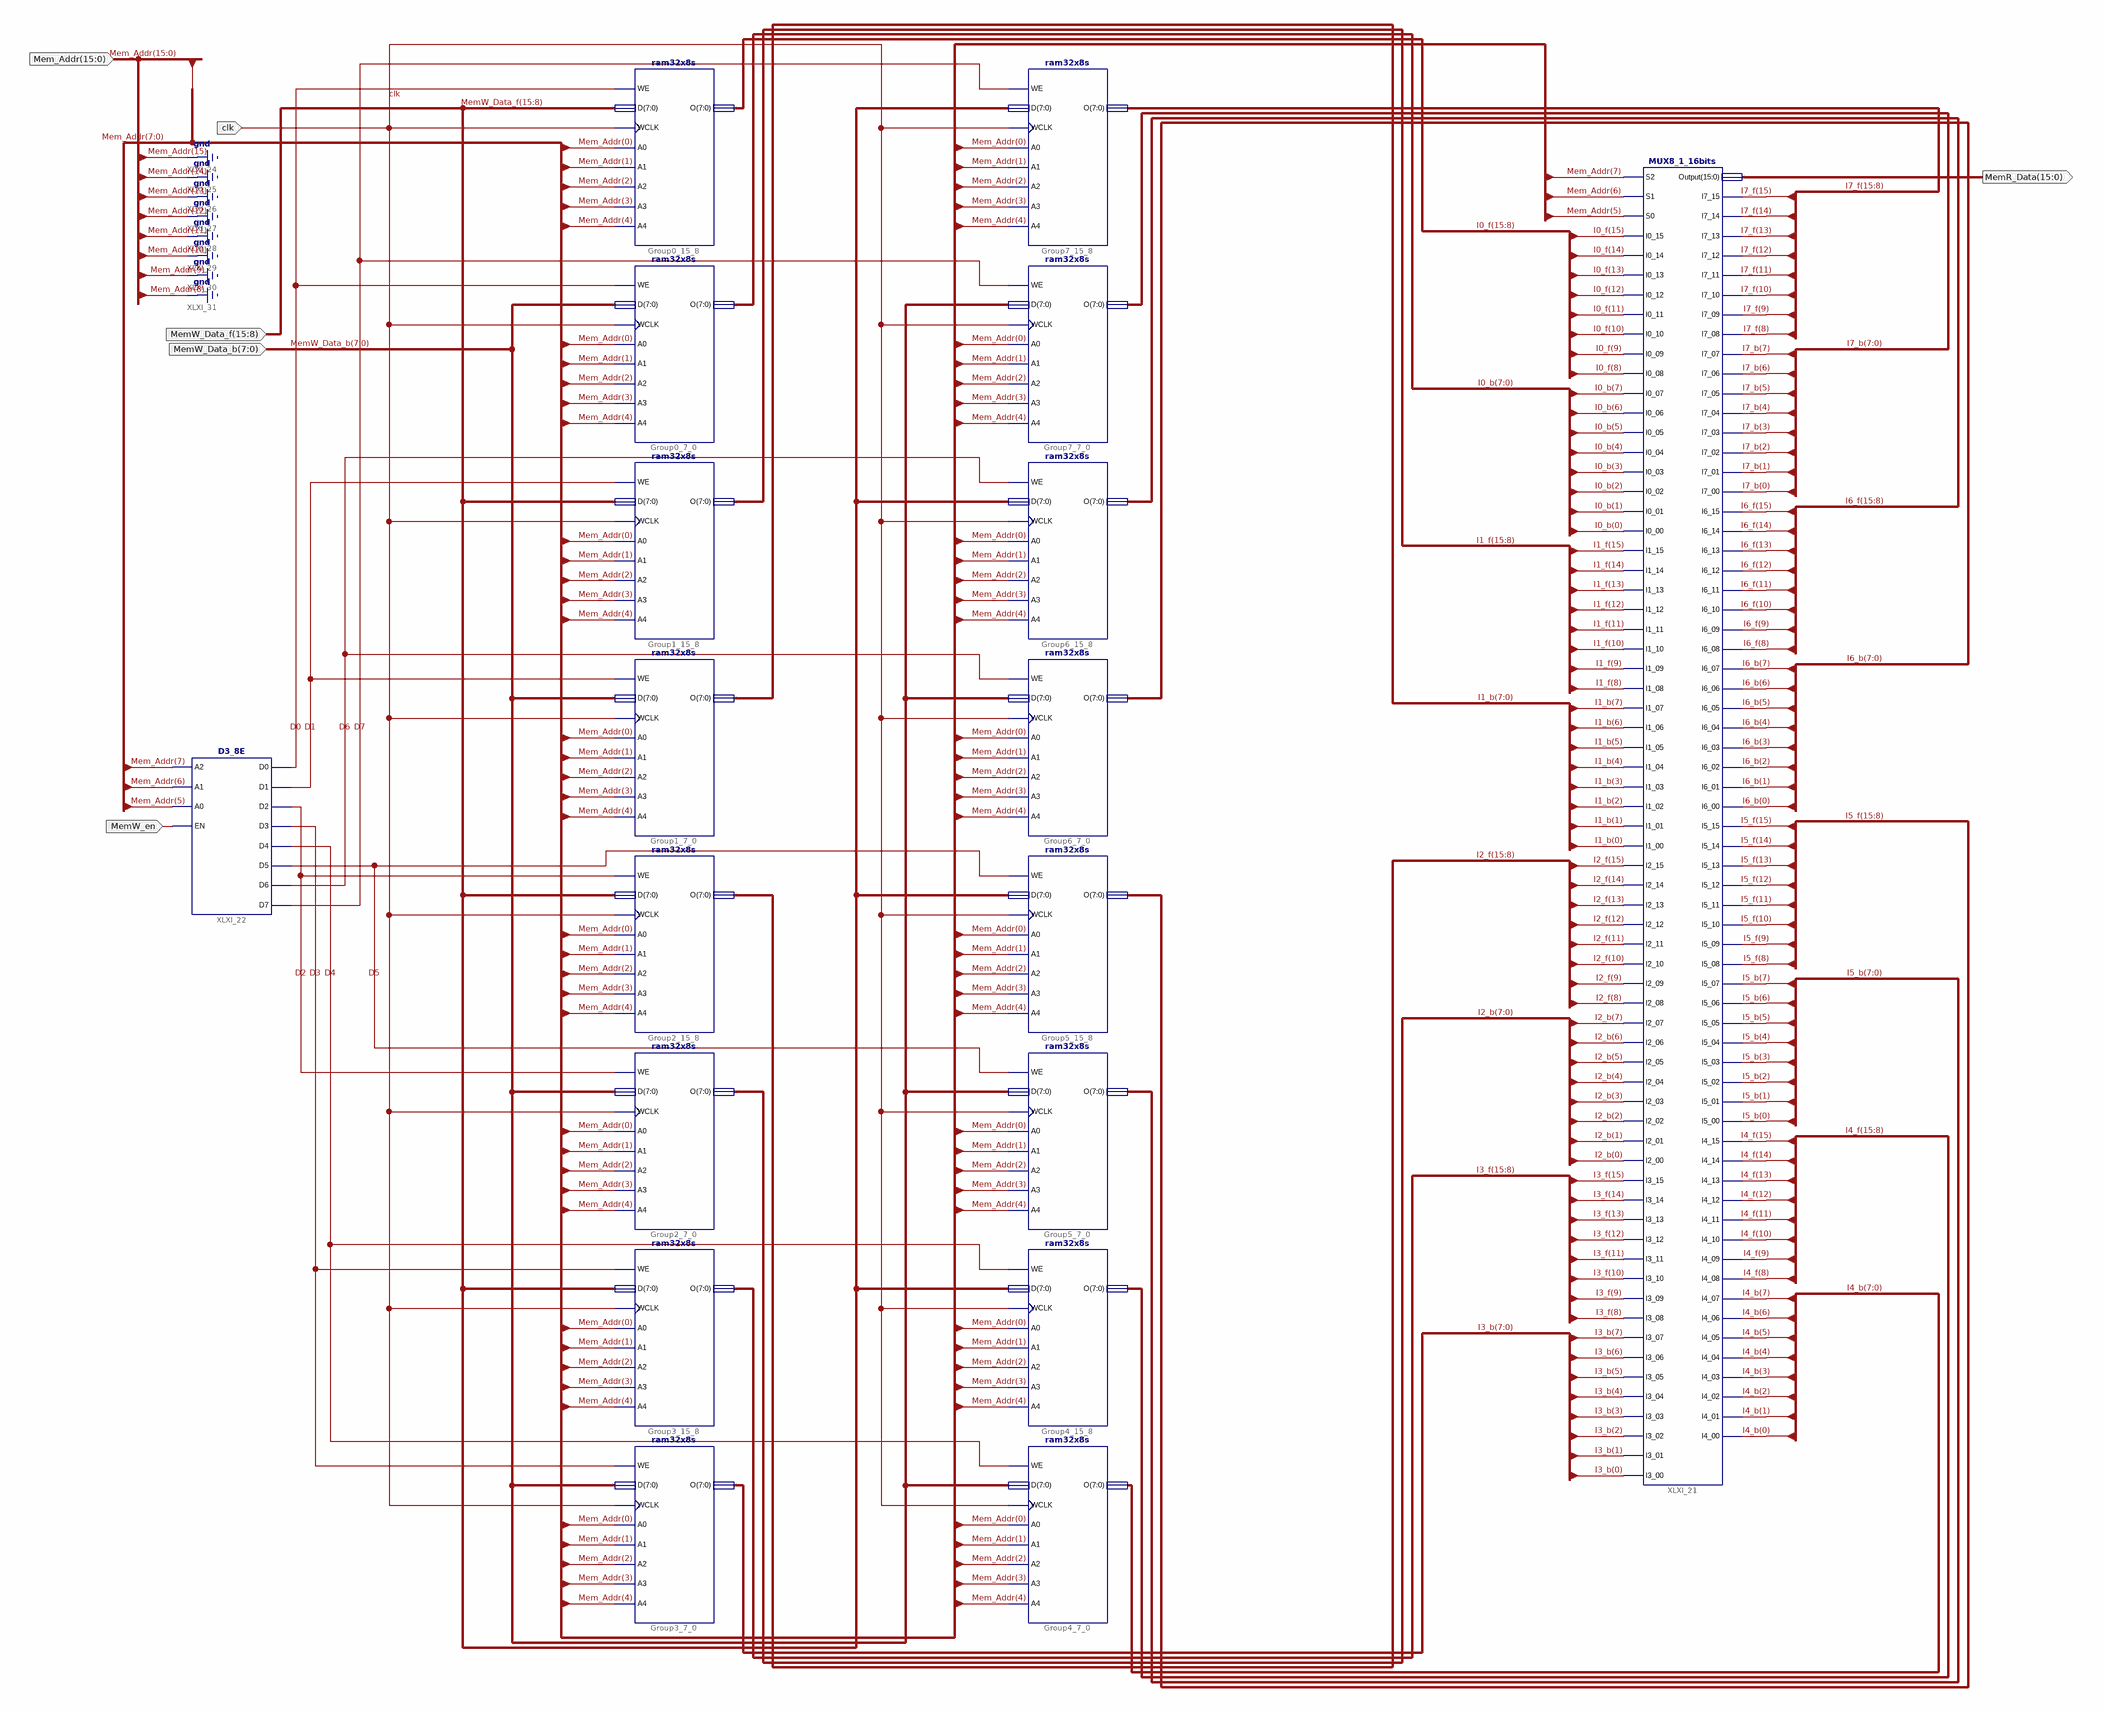
[diagram p0: schematic sheet 1]
// Xilinx ISE schematic Mem_256x16.sch (virtex6) as structural Verilog: 18 symbols, 6 ports
module Mem_256x16 (
  input  clk,
  input  [15:8] MemW_Data_f,
  input  [7:0] MemW_Data_b,
  input  MemW_en,
  input  [15:0] Mem_Addr,
  output [15:0] MemR_Data
);

  wire D0, D1, D2, D3, D4, D5, D6, D7;
  wire [7:0] I0_b, I1_b, I2_b, I3_b, I4_b, I5_b, I6_b, I7_b;
  wire [15:8] I0_f, I1_f, I2_f, I3_f, I4_f, I5_f, I6_f, I7_f;

  ram32x8s Group0_15_8 (
    .A0(Mem_Addr[0]), .A1(Mem_Addr[1]), .A2(Mem_Addr[2]), .A3(Mem_Addr[3]), .A4(Mem_Addr[4]),
    .D(MemW_Data_f), .WCLK(clk), .WE(D0), .O(I0_f));
  ram32x8s Group0_7_0 (
    .A0(Mem_Addr[0]), .A1(Mem_Addr[1]), .A2(Mem_Addr[2]), .A3(Mem_Addr[3]), .A4(Mem_Addr[4]),
    .D(MemW_Data_b), .WCLK(clk), .WE(D0), .O(I0_b));
  ram32x8s Group1_15_8 (
    .A0(Mem_Addr[0]), .A1(Mem_Addr[1]), .A2(Mem_Addr[2]), .A3(Mem_Addr[3]), .A4(Mem_Addr[4]),
    .D(MemW_Data_f), .WCLK(clk), .WE(D1), .O(I1_f));
  ram32x8s Group1_7_0 (
    .A0(Mem_Addr[0]), .A1(Mem_Addr[1]), .A2(Mem_Addr[2]), .A3(Mem_Addr[3]), .A4(Mem_Addr[4]),
    .D(MemW_Data_b), .WCLK(clk), .WE(D1), .O(I1_b));
  MUX8_1_16bits XLXI_21 (
    .I4_00(I4_b[0]), .I4_01(I4_b[1]), .I4_02(I4_b[2]), .I4_03(I4_b[3]), .I4_04(I4_b[4]), .I4_05(I4_b[5]),
    .I4_06(I4_b[6]), .I4_07(I4_b[7]), .I4_08(I4_f[8]), .I4_09(I4_f[9]), .I4_10(I4_f[10]), .I4_11(I4_f[11]),
    .I4_12(I4_f[12]), .I4_13(I4_f[13]), .I4_14(I4_f[14]), .I4_15(I4_f[15]), .I5_00(I5_b[0]), .I5_01(I5_b[1]),
    .I5_02(I5_b[2]), .I5_03(I5_b[3]), .I5_04(I5_b[4]), .I5_05(I5_b[5]), .I5_06(I5_b[6]), .I5_07(I5_b[7]),
    .I5_08(I5_f[8]), .I5_09(I5_f[9]), .I5_10(I5_f[10]), .I5_11(I5_f[11]), .I5_12(I5_f[12]), .I5_13(I5_f[13]),
    .I5_14(I5_f[14]), .I5_15(I5_f[15]), .I6_00(I6_b[0]), .I6_01(I6_b[1]), .I6_02(I6_b[2]), .I6_03(I6_b[3]),
    .I6_04(I6_b[4]), .I6_05(I6_b[5]), .I6_06(I6_b[6]), .I6_07(I6_b[7]), .I6_08(I6_f[8]), .I6_09(I6_f[9]),
    .I6_10(I6_f[10]), .I6_11(I6_f[11]), .I6_12(I6_f[12]), .I6_13(I6_f[13]), .I6_14(I6_f[14]),
    .I6_15(I6_f[15]), .I7_00(I7_b[0]), .I7_01(I7_b[1]), .I7_02(I7_b[2]), .I7_03(I7_b[3]), .I7_04(I7_b[4]),
    .I7_05(I7_b[5]), .I7_06(I7_b[6]), .I7_07(I7_b[7]), .I7_08(I7_f[8]), .I7_09(I7_f[9]), .I7_10(I7_f[10]),
    .I7_11(I7_f[11]), .I7_12(I7_f[12]), .I7_13(I7_f[13]), .I7_14(I7_f[14]), .I7_15(I7_f[15]),
    .Output(MemR_Data), .S2(Mem_Addr[7]), .S1(Mem_Addr[6]), .S0(Mem_Addr[5]), .I3_15(I3_f[15]),
    .I3_14(I3_f[14]), .I3_13(I3_f[13]), .I3_12(I3_f[12]), .I3_11(I3_f[11]), .I3_10(I3_f[10]),
    .I3_09(I3_f[9]), .I3_08(I3_f[8]), .I3_07(I3_b[7]), .I3_06(I3_b[6]), .I3_05(I3_b[5]), .I3_04(I3_b[4]),
    .I3_03(I3_b[3]), .I3_02(I3_b[2]), .I3_01(I3_b[1]), .I3_00(I3_b[0]), .I2_15(I2_f[15]), .I2_14(I2_f[14]),
    .I2_13(I2_f[13]), .I2_12(I2_f[12]), .I2_11(I2_f[11]), .I2_10(I2_f[10]), .I2_09(I2_f[9]), .I2_08(I2_f[8]),
    .I2_07(I2_b[7]), .I2_06(I2_b[6]), .I2_05(I2_b[5]), .I2_04(I2_b[4]), .I2_03(I2_b[3]), .I2_02(I2_b[2]),
    .I2_01(I2_b[1]), .I2_00(I2_b[0]), .I1_15(I1_f[15]), .I1_14(I1_f[14]), .I1_13(I1_f[13]), .I1_12(I1_f[12]),
    .I1_11(I1_f[11]), .I1_10(I1_f[10]), .I1_09(I1_f[9]), .I1_08(I1_f[8]), .I1_07(I1_b[7]), .I1_06(I1_b[6]),
    .I1_05(I1_b[5]), .I1_04(I1_b[4]), .I1_03(I1_b[3]), .I1_02(I1_b[2]), .I1_01(I1_b[1]), .I1_00(I1_b[0]),
    .I0_15(I0_f[15]), .I0_14(I0_f[14]), .I0_13(I0_f[13]), .I0_12(I0_f[12]), .I0_11(I0_f[11]),
    .I0_10(I0_f[10]), .I0_09(I0_f[9]), .I0_08(I0_f[8]), .I0_07(I0_b[7]), .I0_06(I0_b[6]), .I0_05(I0_b[5]),
    .I0_04(I0_b[4]), .I0_03(I0_b[3]), .I0_02(I0_b[2]), .I0_01(I0_b[1]), .I0_00(I0_b[0]));
  ram32x8s Group2_7_0 (
    .A0(Mem_Addr[0]), .A1(Mem_Addr[1]), .A2(Mem_Addr[2]), .A3(Mem_Addr[3]), .A4(Mem_Addr[4]),
    .D(MemW_Data_b), .WCLK(clk), .WE(D2), .O(I2_b));
  ram32x8s Group3_15_8 (
    .A0(Mem_Addr[0]), .A1(Mem_Addr[1]), .A2(Mem_Addr[2]), .A3(Mem_Addr[3]), .A4(Mem_Addr[4]),
    .D(MemW_Data_f), .WCLK(clk), .WE(D3), .O(I3_f));
  ram32x8s Group3_7_0 (
    .A0(Mem_Addr[0]), .A1(Mem_Addr[1]), .A2(Mem_Addr[2]), .A3(Mem_Addr[3]), .A4(Mem_Addr[4]),
    .D(MemW_Data_b), .WCLK(clk), .WE(D3), .O(I3_b));
  ram32x8s Group2_15_8 (
    .A0(Mem_Addr[0]), .A1(Mem_Addr[1]), .A2(Mem_Addr[2]), .A3(Mem_Addr[3]), .A4(Mem_Addr[4]),
    .D(MemW_Data_f), .WCLK(clk), .WE(D2), .O(I2_f));
  ram32x8s Group7_15_8 (
    .A0(Mem_Addr[0]), .A1(Mem_Addr[1]), .A2(Mem_Addr[2]), .A3(Mem_Addr[3]), .A4(Mem_Addr[4]),
    .D(MemW_Data_f), .WCLK(clk), .WE(D7), .O(I7_f));
  ram32x8s Group7_7_0 (
    .A0(Mem_Addr[0]), .A1(Mem_Addr[1]), .A2(Mem_Addr[2]), .A3(Mem_Addr[3]), .A4(Mem_Addr[4]),
    .D(MemW_Data_b), .WCLK(clk), .WE(D7), .O(I7_b));
  ram32x8s Group6_15_8 (
    .A0(Mem_Addr[0]), .A1(Mem_Addr[1]), .A2(Mem_Addr[2]), .A3(Mem_Addr[3]), .A4(Mem_Addr[4]),
    .D(MemW_Data_f), .WCLK(clk), .WE(D6), .O(I6_f));
  ram32x8s Group6_7_0 (
    .A0(Mem_Addr[0]), .A1(Mem_Addr[1]), .A2(Mem_Addr[2]), .A3(Mem_Addr[3]), .A4(Mem_Addr[4]),
    .D(MemW_Data_b), .WCLK(clk), .WE(D6), .O(I6_b));
  ram32x8s Group5_15_8 (
    .A0(Mem_Addr[0]), .A1(Mem_Addr[1]), .A2(Mem_Addr[2]), .A3(Mem_Addr[3]), .A4(Mem_Addr[4]),
    .D(MemW_Data_f), .WCLK(clk), .WE(D5), .O(I5_f));
  ram32x8s Group5_7_0 (
    .A0(Mem_Addr[0]), .A1(Mem_Addr[1]), .A2(Mem_Addr[2]), .A3(Mem_Addr[3]), .A4(Mem_Addr[4]),
    .D(MemW_Data_b), .WCLK(clk), .WE(D5), .O(I5_b));
  ram32x8s Group4_15_8 (
    .A0(Mem_Addr[0]), .A1(Mem_Addr[1]), .A2(Mem_Addr[2]), .A3(Mem_Addr[3]), .A4(Mem_Addr[4]),
    .D(MemW_Data_f), .WCLK(clk), .WE(D4), .O(I4_f));
  ram32x8s Group4_7_0 (
    .A0(Mem_Addr[0]), .A1(Mem_Addr[1]), .A2(Mem_Addr[2]), .A3(Mem_Addr[3]), .A4(Mem_Addr[4]),
    .D(MemW_Data_b), .WCLK(clk), .WE(D4), .O(I4_b));
  D3_8E XLXI_22 (
    .A0(Mem_Addr[5]), .A1(Mem_Addr[6]), .A2(Mem_Addr[7]), .D0(D0), .D1(D1), .D2(D2), .D3(D3), .D4(D4),
    .D5(D5), .D6(D6), .D7(D7), .EN(MemW_en));
  // also tied to GND on the sheet: {Mem_Addr[8], Mem_Addr[9], Mem_Addr[10], Mem_Addr[11], Mem_Addr[12], Mem_Addr[13], Mem_Addr[14], Mem_Addr[15]}
endmodule
